# Altium schematic sheet AFE.SchDoc: FIT_PM12 board
size 420 x 297 mm; CheckedBy: G.Kasprowicz; Author: INR Moscow; CompanyName: WUT ISE; DrawnBy: M.Podgórski; Organization: WUT ISE; Address1: PW ISE; Address2: Nowowiejska 15/19 00-665 Warsaw; Address3: gkasprow@gmail.com; DocumentNumber: 2; Revision: 2; SheetNumber: 6; SheetTotal: 34; ModifiedBy: -; CheckedDate: -; Title2: AFEs; DivGrp: WUT ISE; Designer: INR RAS; ModifiedDate: -; ProjectName: Sensor Box
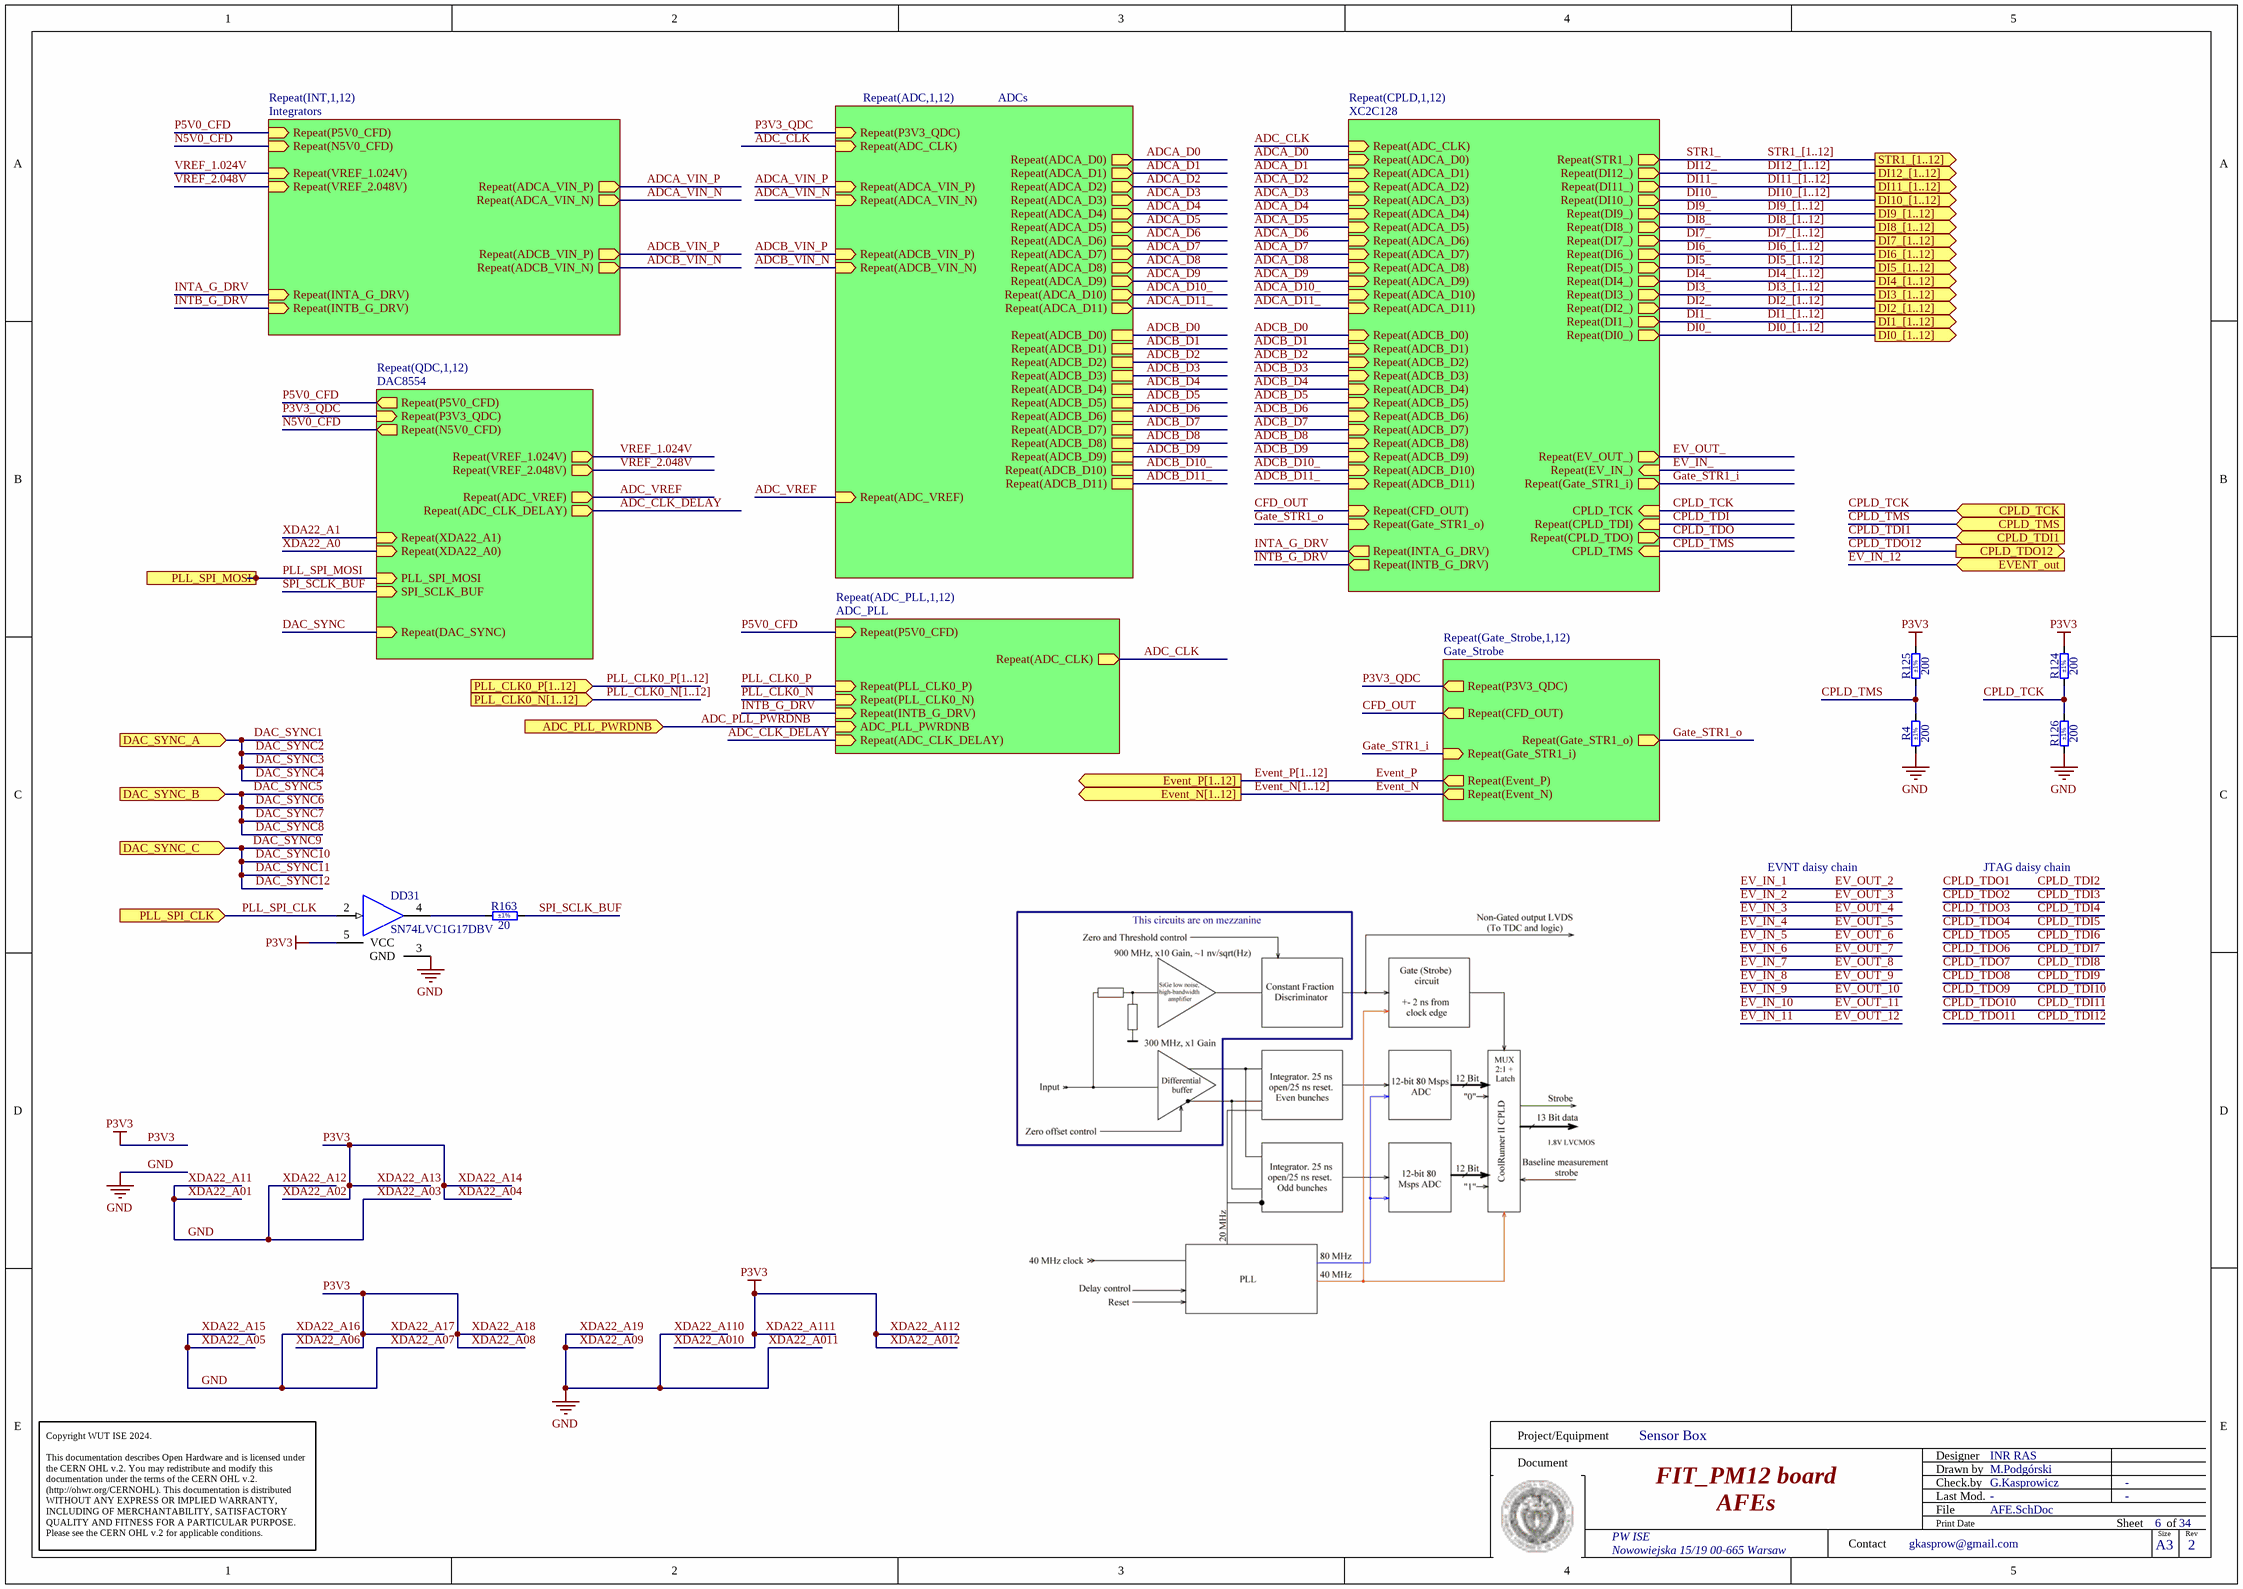
[diagram p0: AFE.SchDoc]

## Parts
DD31  SN74LVC1G17DBV  [SOT95P280X145-5N]
R4  200  Tolerance: ±1%  [RESC2012X60N]
R124  200  Tolerance: ±1%  [RESC2012X60N]
R125  200  Tolerance: ±1%  [RESC2012X60N]
R126  200  Tolerance: ±1%  [RESC2012X60N]
R163  20  Tolerance: ±1%  [RESC2012X60N]

## Sub-sheets
Repeat(ADC,1,12) = ADCs: Repeat(P3V3_QDC) (in), Repeat(ADCA_VIN_N) (in), Repeat(ADCA_VIN_P) (in), Repeat(ADC_VREF) (in), Repeat(ADCA_D6) (out), Repeat(ADCA_D5) (out), Repeat(ADCA_D4) (out), Repeat(ADCA_D3) (out), Repeat(ADCA_D2) (out), Repeat(ADCA_D1) (out), Repeat(ADCA_D0) (out), Repeat(ADCA_D8) (out), Repeat(ADCA_D7) (out), Repeat(ADCA_D10) (out), Repeat(ADCA_D9) (out), Repeat(ADCA_D11) (out), Repeat(ADCB_D11), Repeat(ADCB_D9), Repeat(ADCB_D8), Repeat(ADCB_D0), Repeat(ADCB_D1), Repeat(ADCB_D2), Repeat(ADCB_D3), Repeat(ADCB_D4), Repeat(ADCB_D5), Repeat(ADCB_D6), Repeat(ADCB_D7), Repeat(ADC_CLK) (in), Repeat(ADCB_VIN_N) (in), Repeat(ADCB_D10), Repeat(ADCB_VIN_P) (in)
Repeat(ADC_PLL,1,12) = ADC_PLL: Repeat(PLL_CLK0_P) (in), Repeat(PLL_CLK0_N) (in), ADC_PLL_PWRDNB (in), Repeat(ADC_CLK_DELAY) (in), Repeat(P5V0_CFD) (in), Repeat(ADC_CLK) (out), Repeat(INTB_G_DRV) (in)
Repeat(CPLD,1,12) = XC2C128: Repeat(INTA_G_DRV) (out), Repeat(INTB_G_DRV) (out), Repeat(ADC_CLK) (in), Repeat(Gate_STR1_i) (out), Repeat(Gate_STR1_o) (in), Repeat(CFD_OUT) (in), Repeat(CPLD_TDI) (in), Repeat(DI0_) (out), Repeat(DI1_) (out), Repeat(DI2_) (out), Repeat(DI3_) (out), Repeat(DI4_) (out), Repeat(DI5_) (out), Repeat(DI6_) (out), Repeat(DI7_) (out), Repeat(DI8_) (out), Repeat(STR1_) (out), Repeat(DI12_) (out), Repeat(DI11_) (out), Repeat(DI10_) (out), Repeat(DI9_) (out), Repeat(ADCA_D6) (in), Repeat(ADCA_D5) (in), Repeat(ADCA_D4) (in), Repeat(ADCA_D3) (in), Repeat(ADCA_D2) (in), Repeat(ADCA_D1) (in), Repeat(ADCA_D0) (in), Repeat(ADCB_D11) (in), Repeat(ADCB_D10) (in), Repeat(ADCB_D9) (in), Repeat(ADCB_D8) (in), Repeat(ADCA_D8) (in), Repeat(ADCA_D7) (in), Repeat(ADCA_D10) (in), Repeat(ADCA_D9) (in), Repeat(EV_OUT_) (out), Repeat(ADCA_D11) (in), Repeat(ADCB_D0) (in), Repeat(ADCB_D1) (in), Repeat(ADCB_D2) (in), Repeat(ADCB_D3) (in), Repeat(ADCB_D4) (in), Repeat(ADCB_D5) (in), Repeat(ADCB_D6) (in), Repeat(ADCB_D7) (in), Repeat(EV_IN_) (in), Repeat(CPLD_TDO) (out), CPLD_TCK (in), CPLD_TMS (in)
Repeat(Gate_Strobe,1,12) = Gate_Strobe: Repeat(Gate_STR1_i) (in), Repeat(Event_P) (out), Repeat(Event_N) (out), Repeat(P3V3_QDC) (out), Repeat(Gate_STR1_o) (out), Repeat(CFD_OUT) (out)
Repeat(INT,1,12) = Integrators: Repeat(N5V0_CFD) (in), Repeat(P5V0_CFD) (in), Repeat(INTA_G_DRV) (in), Repeat(INTB_G_DRV) (in), Repeat(VREF_2.048V) (in), Repeat(VREF_1.024V) (in), Repeat(ADCA_VIN_P) (out), Repeat(ADCA_VIN_N) (out), Repeat(ADCB_VIN_P) (out), Repeat(ADCB_VIN_N) (out)
Repeat(QDC,1,12) = DAC8554: Repeat(ADC_CLK_DELAY) (out), PLL_SPI_MOSI (in), SPI_SCLK_BUF (in), Repeat(DAC_SYNC) (in), Repeat(P5V0_CFD) (out), Repeat(N5V0_CFD) (out), Repeat(P3V3_QDC) (in), Repeat(VREF_2.048V) (out), Repeat(VREF_1.024V) (out), Repeat(ADC_VREF) (out), Repeat(XDA22_A1) (in), Repeat(XDA22_A0) (in)

## Ports
ADC_PLL_PWRDNB (in), CPLD_TCK (in), CPLD_TDI1 (in), CPLD_TDO12 (out), CPLD_TMS (in), DAC_SYNC_A (in), DAC_SYNC_B (in), DAC_SYNC_C (in), DI0_[1..12] (out), DI1_[1..12] (out), DI2_[1..12] (out), DI3_[1..12] (out), DI4_[1..12] (out), DI5_[1..12] (out), DI6_[1..12] (out), DI7_[1..12] (out), DI8_[1..12] (out), DI9_[1..12] (out), DI10_[1..12] (out), DI11_[1..12] (out), DI12_[1..12] (out), Event_N[1..12] (out), EVENT_out (in), Event_P[1..12] (out), PLL_CLK0_N[1..12] (in), PLL_CLK0_P[1..12] (in), PLL_SPI_CLK (in), PLL_SPI_MOSI (in), STR1_[1..12] (out)

## Nets
GND: DD31.3(GND) R4.1 R126.1  [also labelled XDA22_A01, XDA22_A011, XDA22_A03, XDA22_A05, XDA22_A07, XDA22_A09, XDA22_A11, XDA22_A110, XDA22_A12, XDA22_A15, XDA22_A16, XDA22_A19]
P3V3: DD31.5(VCC) R124.2 R125.2  [also labelled XDA22_A010, XDA22_A012, XDA22_A02, XDA22_A04, XDA22_A06, XDA22_A08, XDA22_A111, XDA22_A112, XDA22_A13, XDA22_A14, XDA22_A17, XDA22_A18]
ADC_CLK: sheet Repeat(ADC,1,12)/Repeat(ADC_CLK), sheet Repeat(CPLD,1,12)/Repeat(ADC_CLK), sheet Repeat(ADC_PLL,1,12)/Repeat(ADC_CLK)
ADC_CLK_DELAY: sheet Repeat(QDC,1,12)/Repeat(ADC_CLK_DELAY), sheet Repeat(ADC_PLL,1,12)/Repeat(ADC_CLK_DELAY)
ADC_PLL_PWRDNB: port ADC_PLL_PWRDNB, sheet Repeat(ADC_PLL,1,12)/ADC_PLL_PWRDNB
ADC_VREF: sheet Repeat(ADC,1,12)/Repeat(ADC_VREF), sheet Repeat(QDC,1,12)/Repeat(ADC_VREF)
ADCA_D0: sheet Repeat(ADC,1,12)/Repeat(ADCA_D0), sheet Repeat(CPLD,1,12)/Repeat(ADCA_D0)
ADCA_D1: sheet Repeat(ADC,1,12)/Repeat(ADCA_D1), sheet Repeat(CPLD,1,12)/Repeat(ADCA_D1)
ADCA_D2: sheet Repeat(ADC,1,12)/Repeat(ADCA_D2), sheet Repeat(CPLD,1,12)/Repeat(ADCA_D2)
ADCA_D3: sheet Repeat(ADC,1,12)/Repeat(ADCA_D3), sheet Repeat(CPLD,1,12)/Repeat(ADCA_D3)
ADCA_D4: sheet Repeat(ADC,1,12)/Repeat(ADCA_D4), sheet Repeat(CPLD,1,12)/Repeat(ADCA_D4)
ADCA_D5: sheet Repeat(ADC,1,12)/Repeat(ADCA_D5), sheet Repeat(CPLD,1,12)/Repeat(ADCA_D5)
ADCA_D6: sheet Repeat(ADC,1,12)/Repeat(ADCA_D6), sheet Repeat(CPLD,1,12)/Repeat(ADCA_D6)
ADCA_D7: sheet Repeat(ADC,1,12)/Repeat(ADCA_D7), sheet Repeat(CPLD,1,12)/Repeat(ADCA_D7)
ADCA_D8: sheet Repeat(ADC,1,12)/Repeat(ADCA_D8), sheet Repeat(CPLD,1,12)/Repeat(ADCA_D8)
ADCA_D9: sheet Repeat(ADC,1,12)/Repeat(ADCA_D9), sheet Repeat(CPLD,1,12)/Repeat(ADCA_D9)
ADCA_D10_: sheet Repeat(ADC,1,12)/Repeat(ADCA_D10), sheet Repeat(CPLD,1,12)/Repeat(ADCA_D10)
ADCA_D11_: sheet Repeat(ADC,1,12)/Repeat(ADCA_D11), sheet Repeat(CPLD,1,12)/Repeat(ADCA_D11)
ADCA_VIN_N: sheet Repeat(INT,1,12)/Repeat(ADCA_VIN_N), sheet Repeat(ADC,1,12)/Repeat(ADCA_VIN_N)
ADCA_VIN_P: sheet Repeat(INT,1,12)/Repeat(ADCA_VIN_P), sheet Repeat(ADC,1,12)/Repeat(ADCA_VIN_P)
ADCB_D0: sheet Repeat(ADC,1,12)/Repeat(ADCB_D0), sheet Repeat(CPLD,1,12)/Repeat(ADCB_D0)
ADCB_D1: sheet Repeat(ADC,1,12)/Repeat(ADCB_D1), sheet Repeat(CPLD,1,12)/Repeat(ADCB_D1)
ADCB_D2: sheet Repeat(ADC,1,12)/Repeat(ADCB_D2), sheet Repeat(CPLD,1,12)/Repeat(ADCB_D2)
ADCB_D3: sheet Repeat(ADC,1,12)/Repeat(ADCB_D3), sheet Repeat(CPLD,1,12)/Repeat(ADCB_D3)
ADCB_D4: sheet Repeat(ADC,1,12)/Repeat(ADCB_D4), sheet Repeat(CPLD,1,12)/Repeat(ADCB_D4)
ADCB_D5: sheet Repeat(ADC,1,12)/Repeat(ADCB_D5), sheet Repeat(CPLD,1,12)/Repeat(ADCB_D5)
ADCB_D6: sheet Repeat(ADC,1,12)/Repeat(ADCB_D6), sheet Repeat(CPLD,1,12)/Repeat(ADCB_D6)
ADCB_D7: sheet Repeat(ADC,1,12)/Repeat(ADCB_D7), sheet Repeat(CPLD,1,12)/Repeat(ADCB_D7)
ADCB_D8: sheet Repeat(ADC,1,12)/Repeat(ADCB_D8), sheet Repeat(CPLD,1,12)/Repeat(ADCB_D8)
ADCB_D9: sheet Repeat(ADC,1,12)/Repeat(ADCB_D9), sheet Repeat(CPLD,1,12)/Repeat(ADCB_D9)
ADCB_D10_: sheet Repeat(ADC,1,12)/Repeat(ADCB_D10), sheet Repeat(CPLD,1,12)/Repeat(ADCB_D10)
ADCB_D11_: sheet Repeat(ADC,1,12)/Repeat(ADCB_D11), sheet Repeat(CPLD,1,12)/Repeat(ADCB_D11)
ADCB_VIN_N: sheet Repeat(INT,1,12)/Repeat(ADCB_VIN_N), sheet Repeat(ADC,1,12)/Repeat(ADCB_VIN_N)
ADCB_VIN_P: sheet Repeat(INT,1,12)/Repeat(ADCB_VIN_P), sheet Repeat(ADC,1,12)/Repeat(ADCB_VIN_P)
CFD_OUT: sheet Repeat(CPLD,1,12)/Repeat(CFD_OUT), sheet Repeat(Gate_Strobe,1,12)/Repeat(CFD_OUT)
CPLD_TCK: R124.1 R126.2 ; port CPLD_TCK, sheet Repeat(CPLD,1,12)/CPLD_TCK
CPLD_TDI: sheet Repeat(CPLD,1,12)/Repeat(CPLD_TDI)
CPLD_TDI1: port CPLD_TDI1
CPLD_TDO: sheet Repeat(CPLD,1,12)/Repeat(CPLD_TDO)
CPLD_TDO12: port CPLD_TDO12
CPLD_TMS: R4.2 R125.1 ; port CPLD_TMS, sheet Repeat(CPLD,1,12)/CPLD_TMS
DAC_SYNC: sheet Repeat(QDC,1,12)/Repeat(DAC_SYNC)
DAC_SYNC1: port DAC_SYNC_A  [also labelled DAC_SYNC2, DAC_SYNC3, DAC_SYNC4]
DAC_SYNC5: port DAC_SYNC_B  [also labelled DAC_SYNC6, DAC_SYNC7, DAC_SYNC8]
DAC_SYNC10: port DAC_SYNC_C  [also labelled DAC_SYNC11, DAC_SYNC12, DAC_SYNC9]
DI0_: sheet Repeat(CPLD,1,12)/Repeat(DI0_)
DI1_: sheet Repeat(CPLD,1,12)/Repeat(DI1_)
DI2_: sheet Repeat(CPLD,1,12)/Repeat(DI2_)
DI3_: sheet Repeat(CPLD,1,12)/Repeat(DI3_)
DI4_: sheet Repeat(CPLD,1,12)/Repeat(DI4_)
DI5_: sheet Repeat(CPLD,1,12)/Repeat(DI5_)
DI6_: sheet Repeat(CPLD,1,12)/Repeat(DI6_)
DI7_: sheet Repeat(CPLD,1,12)/Repeat(DI7_)
DI8_: sheet Repeat(CPLD,1,12)/Repeat(DI8_)
DI9_: sheet Repeat(CPLD,1,12)/Repeat(DI9_)
DI10_: sheet Repeat(CPLD,1,12)/Repeat(DI10_)
DI11_: sheet Repeat(CPLD,1,12)/Repeat(DI11_)
DI12_: sheet Repeat(CPLD,1,12)/Repeat(DI12_)
EV_IN_: sheet Repeat(CPLD,1,12)/Repeat(EV_IN_)
EV_IN_12: port EVENT_out
EV_OUT_: sheet Repeat(CPLD,1,12)/Repeat(EV_OUT_)
Event_N: sheet Repeat(Gate_Strobe,1,12)/Repeat(Event_N)
Event_P: sheet Repeat(Gate_Strobe,1,12)/Repeat(Event_P)
Gate_STR1_i: sheet Repeat(CPLD,1,12)/Repeat(Gate_STR1_i), sheet Repeat(Gate_Strobe,1,12)/Repeat(Gate_STR1_i)
Gate_STR1_o: sheet Repeat(CPLD,1,12)/Repeat(Gate_STR1_o), sheet Repeat(Gate_Strobe,1,12)/Repeat(Gate_STR1_o)
INTA_G_DRV: sheet Repeat(INT,1,12)/Repeat(INTA_G_DRV), sheet Repeat(CPLD,1,12)/Repeat(INTA_G_DRV)
INTB_G_DRV: sheet Repeat(INT,1,12)/Repeat(INTB_G_DRV), sheet Repeat(CPLD,1,12)/Repeat(INTB_G_DRV), sheet Repeat(ADC_PLL,1,12)/Repeat(INTB_G_DRV)
N5V0_CFD: sheet Repeat(INT,1,12)/Repeat(N5V0_CFD), sheet Repeat(QDC,1,12)/Repeat(N5V0_CFD)
P3V3_QDC: sheet Repeat(ADC,1,12)/Repeat(P3V3_QDC), sheet Repeat(QDC,1,12)/Repeat(P3V3_QDC), sheet Repeat(Gate_Strobe,1,12)/Repeat(P3V3_QDC)
P5V0_CFD: sheet Repeat(INT,1,12)/Repeat(P5V0_CFD), sheet Repeat(QDC,1,12)/Repeat(P5V0_CFD), sheet Repeat(ADC_PLL,1,12)/Repeat(P5V0_CFD)
PLL_CLK0_N: sheet Repeat(ADC_PLL,1,12)/Repeat(PLL_CLK0_N)
PLL_CLK0_P: sheet Repeat(ADC_PLL,1,12)/Repeat(PLL_CLK0_P)
PLL_SPI_CLK: DD31.2(IN) ; port PLL_SPI_CLK
PLL_SPI_MOSI: port PLL_SPI_MOSI, sheet Repeat(QDC,1,12)/PLL_SPI_MOSI
SPI_SCLK_BUF: R163.2 ; sheet Repeat(QDC,1,12)/SPI_SCLK_BUF
STR1_: sheet Repeat(CPLD,1,12)/Repeat(STR1_)
VREF_1.024V: sheet Repeat(INT,1,12)/Repeat(VREF_1.024V), sheet Repeat(QDC,1,12)/Repeat(VREF_1.024V)
VREF_2.048V: sheet Repeat(INT,1,12)/Repeat(VREF_2.048V), sheet Repeat(QDC,1,12)/Repeat(VREF_2.048V)
XDA22_A0: sheet Repeat(QDC,1,12)/Repeat(XDA22_A0)
XDA22_A1: sheet Repeat(QDC,1,12)/Repeat(XDA22_A1)
NetDD31_4: DD31.4(OUT) R163.1

## Buses and harness runs
bus DI0_[1..12] = port DI0_[1..12]
bus DI1_[1..12] = port DI1_[1..12]
bus DI2_[1..12] = port DI2_[1..12]
bus DI3_[1..12] = port DI3_[1..12]
bus DI4_[1..12] = port DI4_[1..12]
bus DI5_[1..12] = port DI5_[1..12]
bus DI6_[1..12] = port DI6_[1..12]
bus DI7_[1..12] = port DI7_[1..12]
bus DI8_[1..12] = port DI8_[1..12]
bus DI9_[1..12] = port DI9_[1..12]
bus DI10_[1..12] = port DI10_[1..12]
bus DI11_[1..12] = port DI11_[1..12]
bus DI12_[1..12] = port DI12_[1..12]
bus Event_N[1..12] = port Event_N[1..12]
bus Event_P[1..12] = port Event_P[1..12]
bus PLL_CLK0_N[1..12] = port PLL_CLK0_N[1..12]
bus PLL_CLK0_P[1..12] = port PLL_CLK0_P[1..12]
bus STR1_[1..12] = port STR1_[1..12]

## Notes on the sheet
- EVNT daisy chain
- JTAG daisy chain
- Project/Equipment
- Document
- Designer
- Drawn by
- Check.by
- Copyright WUT ISE 2024.
  This documentation describes Open Hardware and is licensed under the CERN OHL v.2. You may redistribute and modify this documentation under the terms of the CERN OHL v.2. (http://ohwr.org/CERNOHL). This documentation is distributed WITHOUT ANY EXPRESS OR IMPLIED WARRANTY, INCLUDING OF MERCHANTABILITY, SATISFACTORY QUALITY AND FITNESS FOR A PARTICULAR PURPOSE. Please see the CERN OHL v.2 for applicable conditions.
- Contact
- File
- Last Mod.
- Print Date
- Sheet
- Size
- A3
- of
- Rev

## Library data of the parts
DD31 = SN74LVC1G17DBVR: Single Schmitt-Trigger Buffer; Manufacturer: TEXAS INSTRUMENTS; PressFit: No; Bonding: No; Part Number: SN74LVC1G17DBVR; Component Kind: Standard; Component Type: Standard; Device: SN74LVC1G17DBV; PackageDescription: SOT, 0.95mm Pitch; 5 Pin, 1.60mm W X 2.90mm L X 1.45mm H body, IPC Medium Density; Part Description: Single Schmitt-Trigger Buffer; Manufacturer Part Number: SN74LVC1G17DBV; Pin Count: 5; Case: SOT23-5; Mounted: Yes; Socket: No; SMD: Yes; Sense: No; ComponentHeight: 1.45mm; Author: CERN DEM JLC; HelpURL: \\cern.ch\dfs\Applications\Altium\Datasheets\SN74LVC1G17DBVR.pdf; CreateDate: 06.11.2012; LatestRevisionDate: 06.11.2012
R4 R124-R126 = R0805_200R_1%_0.125W_100PPM: Resistor - 1%; Part Description: General Purpose Thick Film Chip Resistor; Manufacturer: GENERIC; Manufacturer1 Part Number: NRC10F2000TRF; Power: 0.125W; TC: ±100ppm/°C; PressFit: No; Part Number: R0805_200R_1%_0.125W_100PPM; Component Kind: Standard; Component Type: Standard; Pin Count: 2; Value: 200; Status: Preferred; Manufacturer Part Number: R0805_200R_1%_0.125W_100PPM; Case: 0805; Mounted: Yes; Sense: No; Socket: No; SMD: Yes; Manufacturer1 Example: NIC COMPONENT; Manufacturer1 ComponentHeight: 0.6mm; HelpURL: \\cern.ch\dfs\Applications\Altium\Datasheets\R0805_NIC_NRC.pdf; Author: CERN DEM JLC; CreateDate: 03.12.2007; LatestRevisionDate: 13.03.2008
R163 = R0805_20R_1%_0.125W_100PPM: Resistor - 1%; Part Description: General Purpose Thick Film Chip Resistor; Manufacturer: GENERIC; Manufacturer1 Part Number: NRC10F20R0TRF; Power: 0.125W; TC: ±100ppm/°C; PressFit: No; Part Number: R0805_20R_1%_0.125W_100PPM; Component Kind: Standard; Component Type: Standard; Pin Count: 2; Value: 20; Status: Preferred; Manufacturer Part Number: R0805_20R_1%_0.125W_100PPM; Case: 0805; Mounted: Yes; Sense: No; Socket: No; SMD: Yes; Manufacturer1 Example: NIC COMPONENT; Manufacturer1 ComponentHeight: 0.6mm; HelpURL: \\cern.ch\dfs\Applications\Altium\Datasheets\R0805_NIC_NRC.pdf; Author: CERN DEM JLC; CreateDate: 03.12.2007; LatestRevisionDate: 13.03.2008